# EAGLE design project alarm (EAGLE 9.6.2)
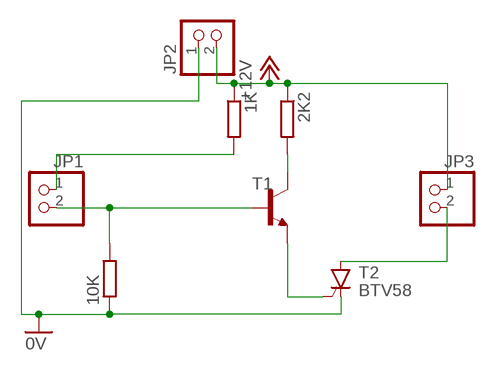
[diagram p0: schematic, sheet 1]

## Parts
1K  R-EU_0207/15  [0207/15]
2K2  R-EU_0207/15  [0207/15]
10K  R-EU_0207/15  [0207/15]
JP1  PINHD-1X2  [1X02]
JP2  PINHD-1X2  [1X02]
JP3  PINHD-1X2  [1X02]
T1  BC107A-NPN-TO18-EBC  [TO18]
T2  BTV58  [TO220CS]

## Nets
0V: 10K.1 JP2.1 T2.C
+12V: 1K.1 2K2.1 JP2.2 JP3.1
N$2: 10K.2 JP1.2 T1.2(B)
N$3: 2K2.2 T1.3(C)
N$4: 1K.2 JP1.1
N$6: T1.1(E) T2.G
N$7: JP3.2 T2.A

## Library data of the parts
1K 2K2 10K = rcl:R-EU_: RESISTOR, European symbol; SPICEPREFIX: R
JP1-JP3 = pinhead:PINHD-1X2: PIN HEADER
T1 = transistor:*-NPN-: NPN Transistror BF959 corrected 2008.03.06
T2 = triac:BTV58: THYRISTOR

## Board
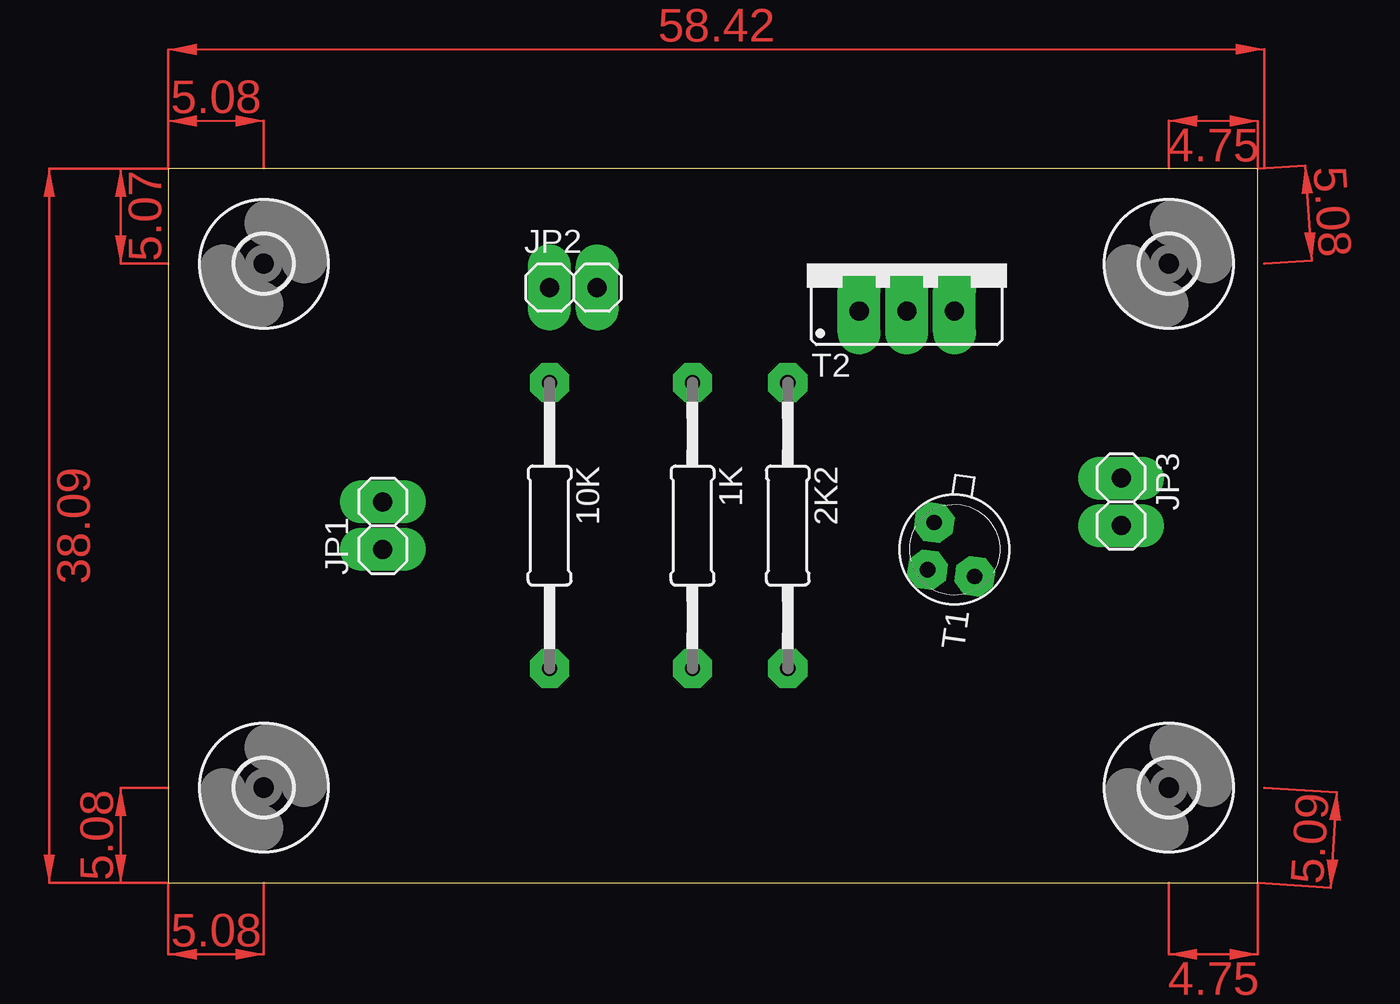
[diagram p1: board, top side]
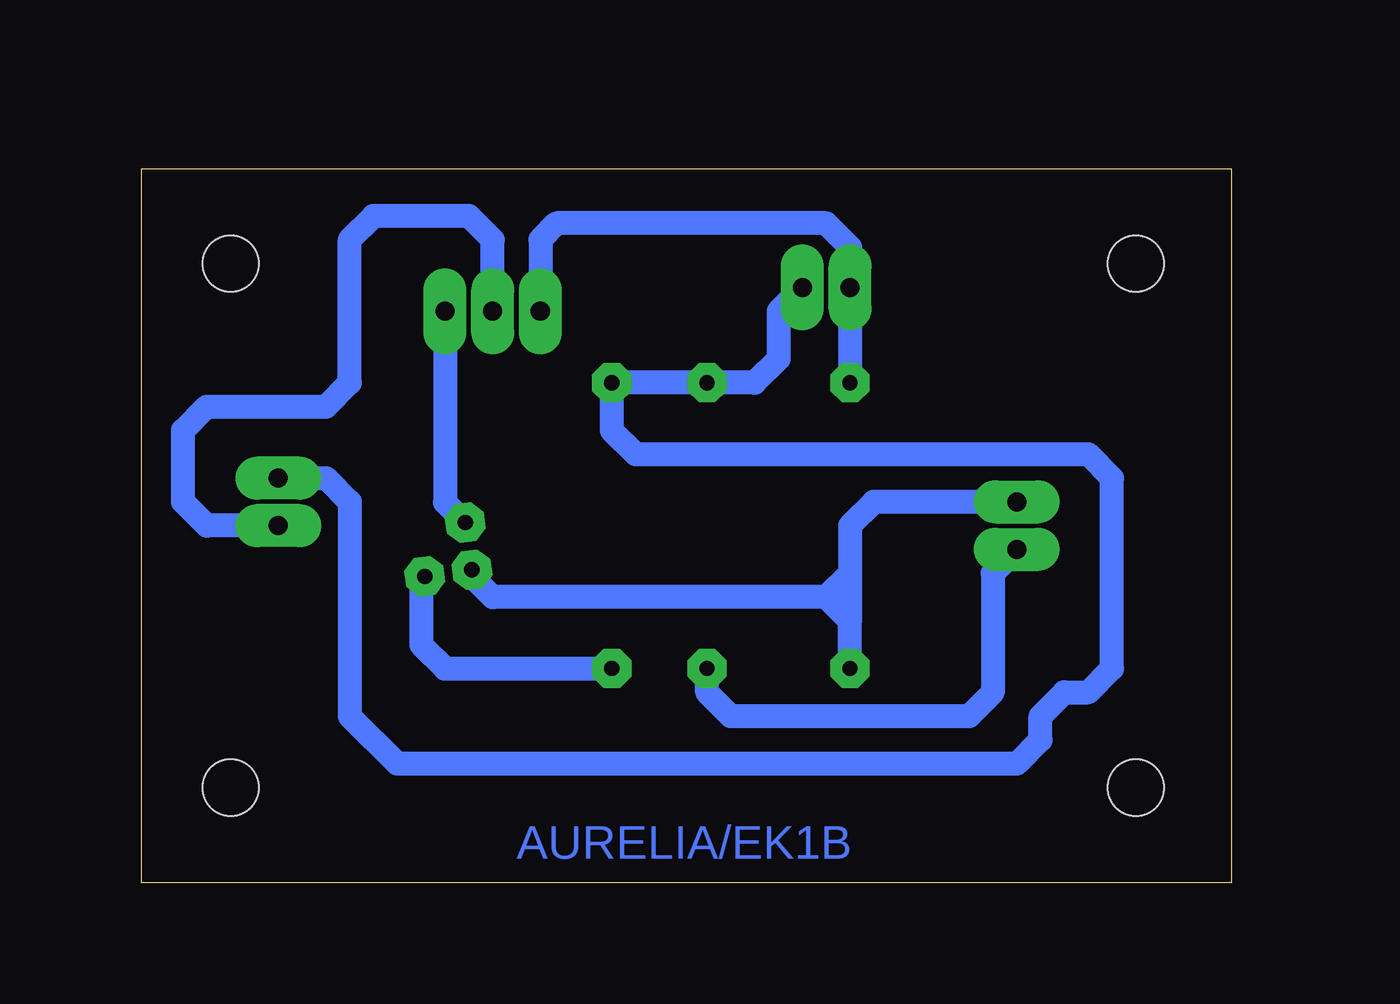
[diagram p2: board, bottom side, seen from below]

Size 58.09 x 38.09 mm. Coordinates in mm from the lower left corner, seen from the top.
Outline: 0,0 58.09,0 58.09,38.09 0,38.09 0,0
Copper layers (1*16): Top 0.035mm / dielectric 1.5mm / Bottom 0.035mm
Design rules "default *": minimum track width 6mil, minimum drill 0.35mm, track to track 10mil, track to pad 10mil, pad to pad 10mil, via to via 10mil, smd to smd 6mil, copper to edge 40mil, drill to drill 6mil, minimum pad ring 25mil, minimum via ring 8mil, stop-mask expansion 4mil, vias tented up to drill 0mil, thermal gap 10mil

### Footprints (pad centres in the part's own frame; a part is rotated, then mirrored left to right if it is on the bottom)
0207/15 = drill 0.813 octagon: 1 -7.62,0; 2 7.62,0
1X02 = drill 1.016 long: 1 -1.27,0; 2 1.27,0
TO18 = drill 0.813 octagon: 1 -1.27,-1.27; 2 1.27,-1.27; 3 1.27,1.27
TO220CS = drill 1.016 long: A 0,-2.54; C -2.54,-2.54; G 2.54,-2.54
3,0 = hole 3: 0,0

### Placement (x,y rotation side)
1K  27.94,19.05 270 top
2K2  33.02,19.05 270 top
10K  20.32,19.05 270 top
JP1  11.43,19.05 90 top
JP2  21.59,31.75 0 top
JP3  50.8,20.32 270 top
T1  41.91,17.78 262 top
T2  39.37,33.02 0 top
U$1  [3,0]  5.08,33.02 0 top
U$2  [3,0]  53.34,33.02 0 top
U$3  [3,0]  5.08,5.08 0 top
U$4  [3,0]  53.34,5.08 0 top

### Tracks (layer width: path | path; a pad name or v marks a point on that pad's centre or on a via)
0V
  Bottom 1.27: 10K.1 JP2.1 20.32,33.9 21.59,35.17 35.95,35.17 36.83,34.29 T2.C
+12V
  Bottom 1.27: JP2.2 24.13,30.48 24.13,27.94 25.4,26.67 1K.1 2K2.1 33.02,24.13 31.75,22.86 7.62,22.86 6.35,21.59 6.35,11.43 7.62,10.16 8.89,10.16 10.16,8.89 10.16,7.62 11.43,6.35 44.45,6.35 46.99,8.89 46.99,20.32 48.26,21.59 JP3.1
N$2
  Bottom 1.27: 10K.2 20.32,13.97 | 20.32,13.97 21.59,15.24 | 21.59,15.24 39.37,15.24 40.48,16.35 T1.2 | 20.32,16.51 20.32,19.05 19.05,20.32 JP1.2 | 20.32,16.51 20.32,13.97 | 20.32,16.51 21.59,15.24
N$3
  Bottom 1.27: T1.3 43.18,16.16 43.18,12.7 41.91,11.43 2K2.2
N$4
  Bottom 1.27: JP1.1 12.7,16.51 12.7,10.16 13.97,8.89 26.67,8.89 27.94,10.16 1K.2
N$6
  Bottom 1.27: T2.G 41.91,20.3 T1.1
N$7
  Bottom 1.27: T2.A 39.37,34.29 40.64,35.56 45.72,35.56 46.99,34.29 46.99,26.67 48.26,25.4 54.61,25.4 55.88,24.13 55.88,20.32 54.61,19.05 JP3.2
(copper drawn outside any net)
  shapes: Top area x10

### Text on the board
Bottom: AURELIA/EK1B